# EAGLE schematic Multiplexer_Circuits (EAGLE 7.3.0)
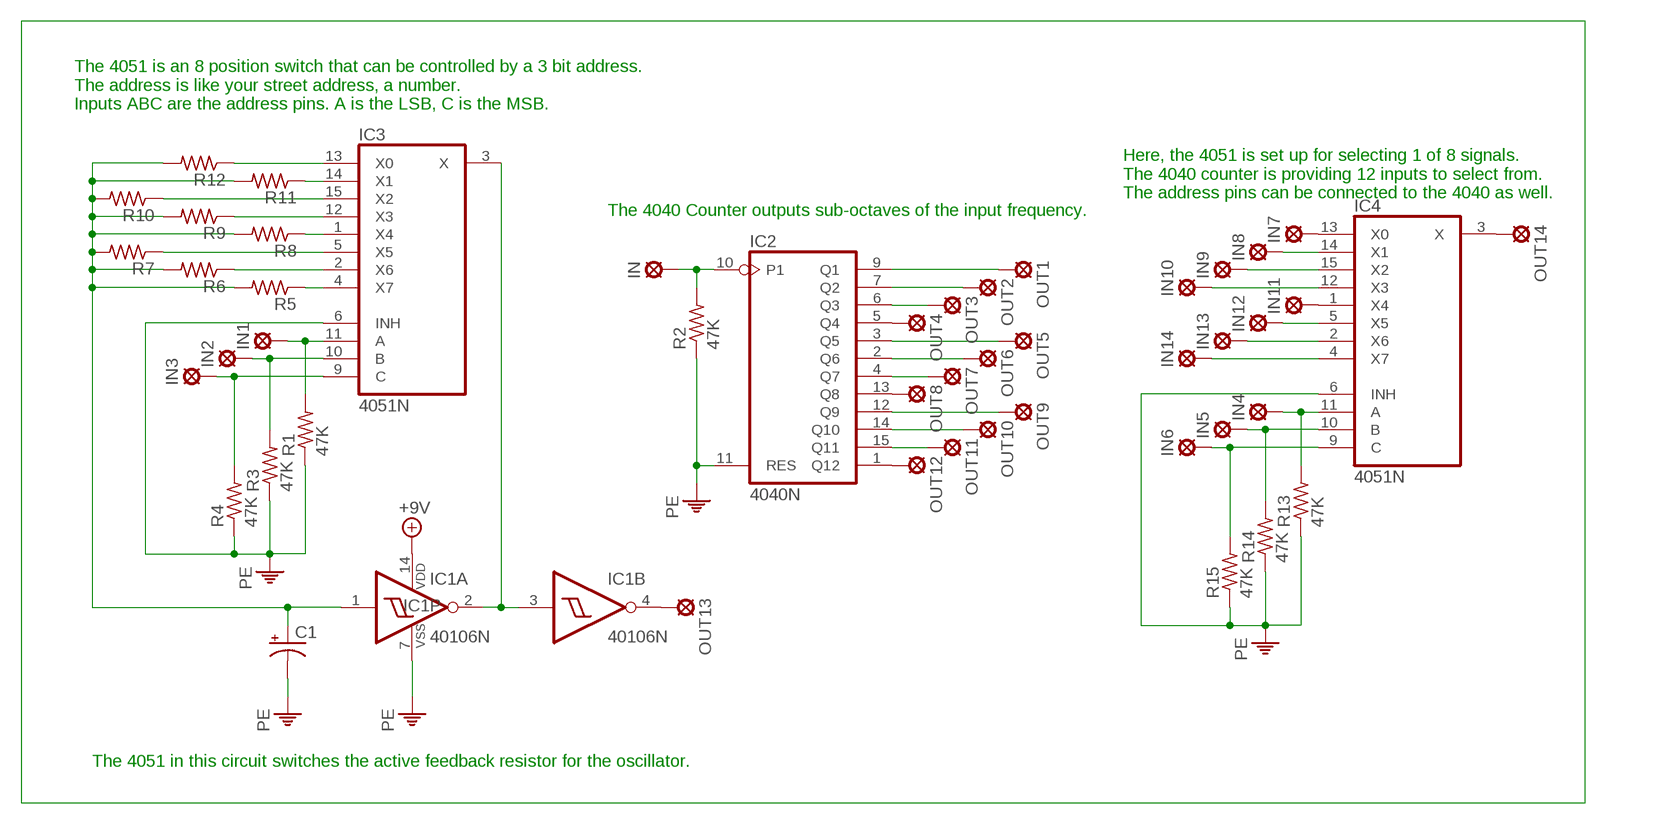
[diagram p0: schematic, sheet 1]

## Parts
C1  CPOL-USE2,5-6E  [E2,5-6E]
IC1  40106N  [DIL14]
IC2  4040N  [DIL16]
IC3  4051N  [DIL16]
IC4  4051N  [DIL16]
IN  MCS10B  [MCS10B]
IN1  MCS10B  [MCS10B]
IN2  MCS10B  [MCS10B]
IN3  MCS10B  [MCS10B]
IN4  MCS10B  [MCS10B]
IN5  MCS10B  [MCS10B]
IN6  MCS10B  [MCS10B]
IN7  MCS10B  [MCS10B]
IN8  MCS10B  [MCS10B]
IN9  MCS10B  [MCS10B]
IN10  MCS10B  [MCS10B]
IN11  MCS10B  [MCS10B]
IN12  MCS10B  [MCS10B]
IN13  MCS10B  [MCS10B]
IN14  MCS10B  [MCS10B]
OUT1  MCS10B  [MCS10B]
OUT2  MCS10B  [MCS10B]
OUT3  MCS10B  [MCS10B]
OUT4  MCS10B  [MCS10B]
OUT5  MCS10B  [MCS10B]
OUT6  MCS10B  [MCS10B]
OUT7  MCS10B  [MCS10B]
OUT8  MCS10B  [MCS10B]
OUT9  MCS10B  [MCS10B]
OUT10  MCS10B  [MCS10B]
OUT11  MCS10B  [MCS10B]
OUT12  MCS10B  [MCS10B]
OUT13  MCS10B  [MCS10B]
OUT14  MCS10B  [MCS10B]
R1  47K  R-US_0204/7  [0204/7]
R2  47K  R-US_0204/7  [0204/7]
R3  47K  R-US_0204/7  [0204/7]
R4  47K  R-US_0204/7  [0204/7]
R5  R-US_0204/7  [0204/7]
R6  R-US_0204/7  [0204/7]
R7  R-US_0204/7  [0204/7]
R8  R-US_0204/7  [0204/7]
R9  R-US_0204/7  [0204/7]
R10  R-US_0204/7  [0204/7]
R11  R-US_0204/7  [0204/7]
R12  R-US_0204/7  [0204/7]
R13  47K  R-US_0204/7  [0204/7]
R14  47K  R-US_0204/7  [0204/7]
R15  47K  R-US_0204/7  [0204/7]

## Nets
+9V: IC1.14(P:VDD)
N$1: IC4.13(X0) IN7.MP
N$2: IC2.10(P1) IN.MP R2.2
N$3: IC1.2(A:O) IC1.3(B:I) IC3.3(X)
N$4: IC3.9(C) IN3.MP R4.2
N$5: IC2.9(Q1) OUT1.MP
N$6: IC2.7(Q2) OUT2.MP
N$7: IC2.5(Q4) OUT4.MP
N$8: IC2.6(Q3) OUT3.MP
N$9: IC2.3(Q5) OUT5.MP
N$10: IC2.2(Q6) OUT6.MP
N$11: IC2.4(Q7) OUT7.MP
N$12: IC2.13(Q8) OUT8.MP
N$13: IC2.1(Q12) OUT12.MP
N$14: IC2.15(Q11) OUT11.MP
N$15: IC2.14(Q10) OUT10.MP
N$16: IC2.12(Q9) OUT9.MP
N$17: IC3.10(B) IN2.MP R3.2
N$18: IC3.11(A) IN1.MP R1.2
N$19: IC3.13(X0) R12.1
N$20: IC3.14(X1) R11.1
N$21: IC3.15(X2) R10.1
N$22: IC3.12(X3) R9.1
N$23: IC3.1(X4) R8.1
N$24: IC3.5(X5) R7.1
N$25: IC3.2(X6) R6.1
N$26: IC3.4(X7) R5.1
N$27: IC4.14(X1) IN8.MP
N$28: C1.+ IC1.1(A:I) R5.2 R6.2 R7.2 R8.2 R9.2 R10.2 R11.2 R12.2
N$29: IC1.4(B:O) OUT13.MP
N$30: IC4.15(X2) IN9.MP
N$31: IC4.9(C) IN6.MP R15.2
N$32: IC4.10(B) IN5.MP R14.2
N$33: IC4.11(A) IN4.MP R13.2
N$34: IC4.12(X3) IN10.MP
N$35: IC4.5(X5) IN12.MP
N$36: IC4.2(X6) IN13.MP
N$37: IC4.4(X7) IN14.MP
N$38: IC4.3(X) OUT14.MP
N$39: IC4.1(X4) IN11.MP
PE: C1.- IC1.7(P:VSS) IC2.11(RES) IC3.6(INH) IC4.6(INH) R1.1 R2.1 R3.1 R4.1 R13.1 R14.1 R15.1
Unconnected: IC1.5(C:I) IC1.6(C:O) IC1.8(D:O) IC1.9(D:I) IC1.10(E:O) IC1.11(E:I) IC1.12(F:O) IC1.13(F:I)

## Notes on the sheet
- The 4051 is an 8 position switch that can be controlled by a 3 bit address.
  The address is like your street address, a number.
  Inputs ABC are the address pins. A is the LSB, C is the MSB.
- Here, the 4051 is set up for selecting 1 of 8 signals.
  The 4040 counter is providing 12 inputs to select from.
  The address pins can be connected to the 4040 as well.
- The 4040 Counter outputs sub-octaves of the input frequency.
- The 4051 in this circuit switches the active feedback resistor for the oscillator.

## Power pins joined to a net without a drawn wire
GND: IC3.8(GND) IC4.8(GND)
VCC: IC3.16(VCC) IC4.16(VCC)
VDD: IC2.16(VDD)
VEE: IC3.7(VEE) IC4.7(VEE)
VSS: IC2.8(VSS)

## Library data of the parts
C1 = rcl:CPOL-US: POLARIZED CAPACITOR, American symbol
IC1 = 40xx:40106: Hex SCHMITT TRIGGER
IC2 = 40xx:4040: 12-stage binary/ripple COUNTER
IC3 IC4 = 40xx:4051: 8-channel ANALOG MULTIPLEXER
IN IN1-IN14 OUT1-OUT14 = solpad:MCS10B: SOLDER PAD MC S1, distributor Buerklin, 15F505
R1-R15 = rcl:R-US_: RESISTOR, American symbol